# EAGLE design LACE_motherboard_xmega (EAGLE 5.07)
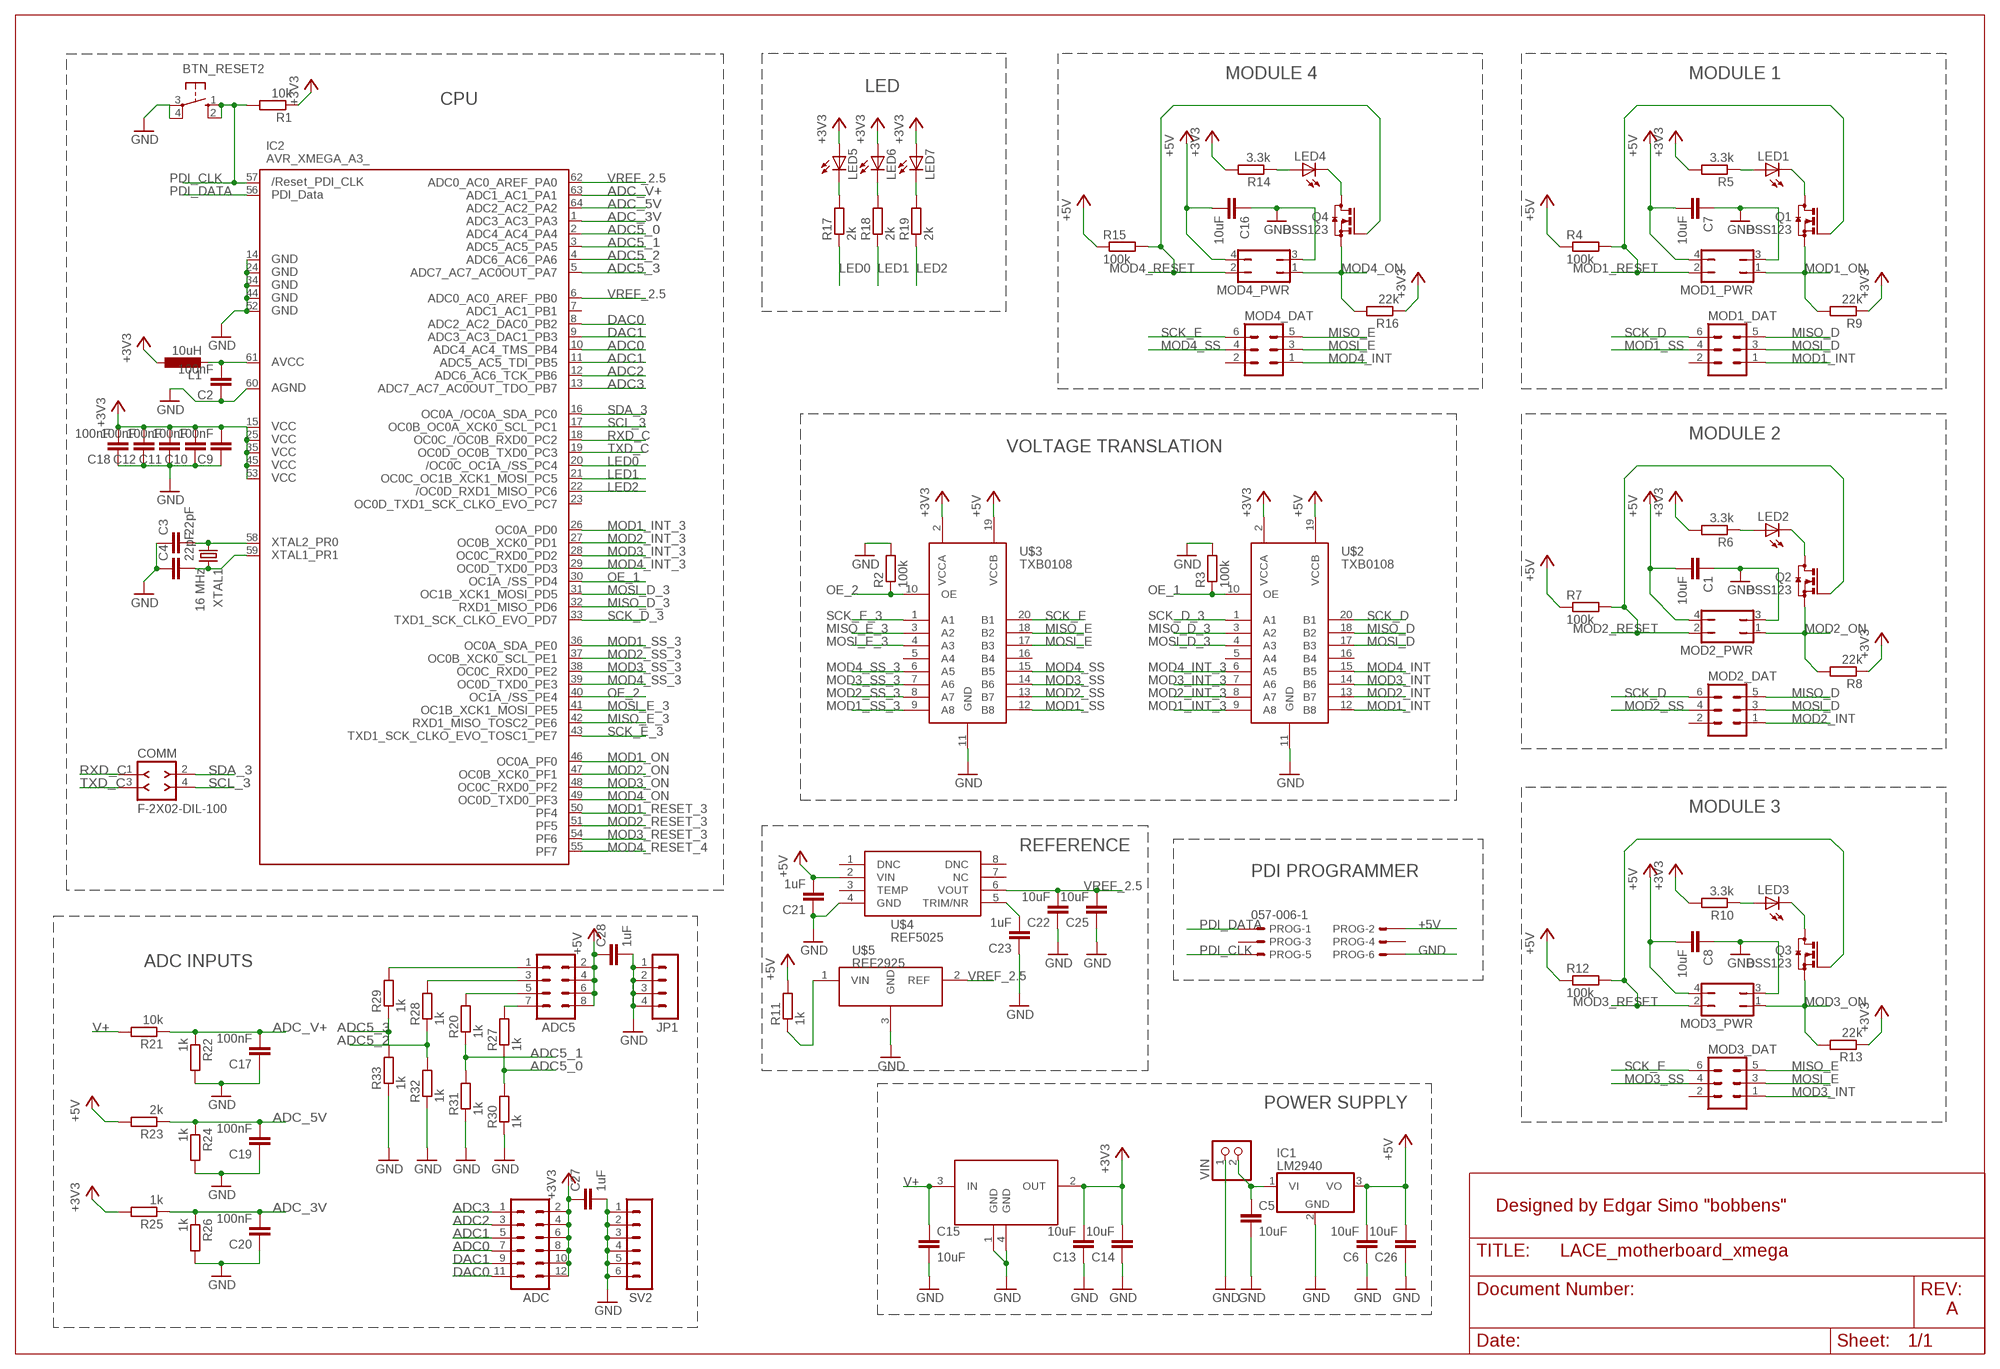
[diagram p0: schematic, sheet 1]

## Parts
ADC  MA06-2  [MA06-2]
ADC5  MA04-2  [MA04-2]
BTN_RESET2  10-XX  [B3F-10XX]
C1  10uF  C-EUC0805  [C0805]
C2  100nF  C-EUC0805  [C0805]
C3  22pF  C-EUC0805  [C0805]
C4  22pF  C-EUC0805  [C0805]
C5  10uF  C-EUC0805  [C0805]
C6  10uF  C-EUC0805  [C0805]
C7  10uF  C-EUC0805  [C0805]
C8  10uF  C-EUC0805  [C0805]
C9  100nF  C-EUC0805  [C0805]
C10  100nF  C-EUC0805  [C0805]
C11  100nF  C-EUC0805  [C0805]
C12  100nF  C-EUC0805  [C0805]
C13  10uF  C-EUC0805  [C0805]
C14  10uF  C-EUC0805  [C0805]
C15  10uF  C-EUC0805  [C0805]
C16  10uF  C-EUC0805  [C0805]
C17  100nF  C-EUC0805  [C0805]
C18  100nF  C-EUC0805  [C0805]
C19  100nF  C-EUC0805  [C0805]
C20  100nF  C-EUC0805  [C0805]
C21  1uF  C-EUC0805  [C0805]
C22  10uF  C-EUC0805  [C0805]
C23  1uF  C-EUC0805  [C0805]
C25  10uF  C-EUC0805  [C0805]
C26  10uF  C-EUC0805  [C0805]
C27  1uF  C-EUC0805  [C0805]
C28  1uF  C-EUC0805  [C0805]
COMM  F-2X02-DIL-100  [DIL-100-2X02]
IC1  LM2940  7815T  [TO220H]
IC2  AVR_XMEGA_A3_  [TQFP64]
JP1  MA04-1  [MA04-1]
L1  10uH  L-EUL0805  [L0805]
LED1  LEDCHIPLED_0805  [CHIPLED_0805]
LED2  LEDCHIPLED_0805  [CHIPLED_0805]
LED3  LEDCHIPLED_0805  [CHIPLED_0805]
LED4  LEDCHIPLED_0805  [CHIPLED_0805]
LED5  LEDCHIPLED_0805  [CHIPLED_0805]
LED6  LEDCHIPLED_0805  [CHIPLED_0805]
LED7  LEDCHIPLED_0805  [CHIPLED_0805]
MOD1_DAT  MA03-2  [MA03-2]
MOD1_PWR  JP2Q  [JP2Q]
MOD2_DAT  MA03-2  [MA03-2]
MOD2_PWR  JP2Q  [JP2Q]
MOD3_DAT  MA03-2  [MA03-2]
MOD3_PWR  JP2Q  [JP2Q]
MOD4_DAT  MA03-2  [MA03-2]
MOD4_PWR  JP2Q  [JP2Q]
PROG  057-006-1  [057-006-1]
Q1  BSS123  [SOT23]
Q2  BSS123  [SOT23]
Q3  BSS123  [SOT23]
Q4  BSS123  [SOT23]
R1  10k  R-EU_M0805  [M0805]
R2  100k  R-EU_M0805  [M0805]
R3  100k  R-EU_M0805  [M0805]
R4  100k  R-EU_M0805  [M0805]
R5  3.3k  R-EU_M0805  [M0805]
R6  3.3k  R-EU_M0805  [M0805]
R7  100k  R-EU_M0805  [M0805]
R8  22k  R-EU_M0805  [M0805]
R9  22k  R-EU_M0805  [M0805]
R10  3.3k  R-EU_M0805  [M0805]
R11  1k  R-EU_M0805  [M0805]
R12  100k  R-EU_M0805  [M0805]
R13  22k  R-EU_M0805  [M0805]
R14  3.3k  R-EU_M0805  [M0805]
R15  100k  R-EU_M0805  [M0805]
R16  22k  R-EU_M0805  [M0805]
R17  2k  R-EU_M0805  [M0805]
R18  2k  R-EU_M0805  [M0805]
R19  2k  R-EU_M0805  [M0805]
R20  1k  R-EU_M0805  [M0805]
R21  10k  R-EU_M0805  [M0805]
R22  1k  R-EU_M0805  [M0805]
R23  2k  R-EU_M0805  [M0805]
R24  1k  R-EU_M0805  [M0805]
R25  1k  R-EU_M0805  [M0805]
R26  1k  R-EU_M0805  [M0805]
R27  1k  R-EU_M0805  [M0805]
R28  1k  R-EU_M0805  [M0805]
R29  1k  R-EU_M0805  [M0805]
R30  1k  R-EU_M0805  [M0805]
R31  1k  R-EU_M0805  [M0805]
R32  1k  R-EU_M0805  [M0805]
R33  1k  R-EU_M0805  [M0805]
SV2  MA06-1  [MA06-1]
U$1  LM1117  [SOT223]
U$2  TXB0108  [R-PDSO-G20]
U$3  TXB0108  [R-PDSO-G20]
U$4  REF5025  [SOIC8]
U$5  REF2925  [SOT23]
VIN  PINHD-1X2  [1X02]
XTAL1  16 MHz  CRYSTALHC49S  [HC49/S]

## Nets
+3V3: ADC.2 ADC.4 ADC.6 ADC.8 ADC.10 ADC.12 C9.2 C10.2 C11.2 C12.2 C13.2 C14.2 C18.2 C27.1 IC2.15(VCC1) IC2.25(VCC2) IC2.35(VCC3) IC2.45(VCC4) IC2.53(VCC5) L1.1 LED5.A LED6.A LED7.A R1.1 R5.2 R6.2 R8.1 R9.1 R10.2 R13.1 R14.2 R16.1 R25.2 U$1.2(OUT) U$2.2(VCCA) U$3.2(VCCA)
+5V: ADC5.2 ADC5.4 ADC5.6 ADC5.8 C1.2 C6.2 C7.2 C8.2 C16.2 C21.2 C26.2 C28.1 IC1.3(VO) MOD1_PWR.4 MOD2_PWR.4 MOD3_PWR.4 MOD4_PWR.4 PROG.2 R4.1 R7.1 R11.2 R12.1 R15.1 R23.2 U$2.19(VCCB) U$3.19(VCCB) U$4.2(VIN)
ADC0: ADC.7 IC2.10(PB4)
ADC1: ADC.5 IC2.11(PB5)
ADC2: ADC.3 IC2.12(PB6)
ADC3: ADC.1 IC2.13(PB7)
ADC5_0: IC2.2(PA4) R27.1 R30.2
ADC5_1: IC2.3(PA5) R20.1 R31.2
ADC5_2: IC2.4(PA6) R28.1 R32.2
ADC5_3: IC2.5(PA7) R29.1 R33.2
ADC_3V: C20.2 IC2.1(PA3) R25.1 R26.1
ADC_5V: C19.2 IC2.64(PA2) R23.1 R24.1
ADC_V+: C17.2 IC2.63(PA1) R21.1 R22.1
DAC0: ADC.11 IC2.8(PB2)
DAC1: ADC.9 IC2.9(PB3)
GND: BTN_RESET2.3(P) BTN_RESET2.4(P1) C1.1 C2.1 C3.1 C4.1 C5.2 C6.1 C7.1 C8.1 C9.1 C10.1 C11.1 C12.1 C13.1 C14.1 C15.2 C16.1 C17.1 C18.1 C19.1 C20.1 C21.1 C22.1 C23.1 C25.1 C26.1 C27.2 C28.2 IC1.2(GND) IC2.14(GND1) IC2.24(GND2) IC2.34(GND3) IC2.44(GND4) IC2.52(GND5) IC2.60(AGND) JP1.1 JP1.2 JP1.3 JP1.4 MOD1_PWR.3 MOD2_PWR.3 MOD3_PWR.3 MOD4_PWR.3 PROG.6 R2.2 R3.2 R22.2 R24.2 R26.2 R30.1 R31.1 R32.1 R33.1 SV2.1 SV2.2 SV2.3 SV2.4 SV2.5 SV2.6 U$1.1(GND) U$1.4(GND) U$2.11(GND) U$3.11(GND) U$4.4(GND) U$5.3(GND) VIN.1
LED0: IC2.20(PC4) R17.1
LED1: IC2.21(PC5) R18.1
LED2: IC2.22(PC6) R19.1
MISO_D: MOD1_DAT.5 MOD2_DAT.5 U$2.18(B2)
MISO_D_3: IC2.32(PD6) U$2.3(A2)
MISO_E: MOD3_DAT.5 MOD4_DAT.5 U$3.18(B2)
MISO_E_3: IC2.42(PE6) U$3.3(A2)
MOD1_INT: MOD1_DAT.1 U$2.12(B8)
MOD1_INT_3: IC2.26(PD0) U$2.9(A8)
MOD1_ON: IC2.46(PF0) MOD1_PWR.1 Q1.2(S) R9.2
MOD1_RESET: MOD1_PWR.2 Q1.1(G) R4.2
MOD1_RESET_3: IC2.50(PF4)
MOD1_SS: MOD1_DAT.4 U$3.12(B8)
MOD1_SS_3: IC2.36(PE0) U$3.9(A8)
MOD2_INT: MOD2_DAT.1 U$2.13(B7)
MOD2_INT_3: IC2.27(PD1) U$2.8(A7)
MOD2_ON: IC2.47(PF1) MOD2_PWR.1 Q2.2(S) R8.2
MOD2_RESET: MOD2_PWR.2 Q2.1(G) R7.2
MOD2_RESET_3: IC2.51(PF5)
MOD2_SS: MOD2_DAT.4 U$3.13(B7)
MOD2_SS_3: IC2.37(PE1) U$3.8(A7)
MOD3_INT: MOD3_DAT.1 U$2.14(B6)
MOD3_INT_3: IC2.28(PD2) U$2.7(A6)
MOD3_ON: IC2.48(PF2) MOD3_PWR.1 Q3.2(S) R13.2
MOD3_RESET: MOD3_PWR.2 Q3.1(G) R12.2
MOD3_RESET_3: IC2.54(PF6)
MOD3_SS: MOD3_DAT.4 U$3.14(B6)
MOD3_SS_3: IC2.38(PE2) U$3.7(A6)
MOD4_INT: MOD4_DAT.1 U$2.15(B5)
MOD4_INT_3: IC2.29(PD3) U$2.6(A5)
MOD4_ON: IC2.49(PF3) MOD4_PWR.1 Q4.2(S) R16.2
MOD4_RESET: MOD4_PWR.2 Q4.1(G) R15.2
MOD4_RESET_4: IC2.55(PF7)
MOD4_SS: MOD4_DAT.4 U$3.15(B5)
MOD4_SS_3: IC2.39(PE3) U$3.6(A5)
MOSI_D: MOD1_DAT.3 MOD2_DAT.3 U$2.17(B3)
MOSI_D_3: IC2.31(PD5) U$2.4(A3)
MOSI_E: MOD3_DAT.3 MOD4_DAT.3 U$3.17(B3)
MOSI_E_3: IC2.41(PE5) U$3.4(A3)
N$1: C3.2 IC2.58(PR0) XTAL1.1
N$2: R11.1 U$5.1(VIN)
N$3: C4.2 IC2.59(PR1) XTAL1.2
N$5: C2.2 IC2.61(AVCC) L1.2
N$13: LED2.A R6.1
N$22: C23.2 U$4.5(TRIM/NR)
N$23: ADC5.1 R29.2
N$24: ADC5.3 R28.2
N$25: ADC5.5 R20.2
N$26: LED1.A R5.1
N$27: ADC5.7 R27.2
N$28: LED2.C Q2.3(D)
N$29: LED1.C Q1.3(D)
N$30: LED3.A R10.1
N$31: LED3.C Q3.3(D)
N$32: LED4.A R14.1
N$33: LED4.C Q4.3(D)
N$34: LED5.C R17.2
N$35: LED6.C R18.2
N$36: LED7.C R19.2
OE_1: IC2.30(PD4) R3.1 U$2.10(OE)
OE_2: IC2.40(PE4) R2.1 U$3.10(OE)
PDI_CLK: BTN_RESET2.1(S) BTN_RESET2.2(S1) IC2.57(RESET) PROG.5 R1.2
PDI_DATA: IC2.56(PDI_DATA) PROG.1
RXD_C: COMM.1 IC2.18(PC2)
SCK_D: MOD1_DAT.6 MOD2_DAT.6 U$2.20(B1)
SCK_D_3: IC2.33(PD7) U$2.1(A1)
SCK_E: MOD3_DAT.6 MOD4_DAT.6 U$3.20(B1)
SCK_E_3: IC2.43(PE7) U$3.1(A1)
SCL_3: COMM.4 IC2.17(PC1)
SDA_3: COMM.2 IC2.16(PC0)
TXD_C: COMM.3 IC2.19(PC3)
V+: C5.1 C15.1 IC1.1(VI) R21.2 U$1.3(IN) VIN.2
VREF_2.5: C22.2 C25.2 IC2.6(PB0) IC2.62(PA0) U$4.6(VOUT) U$5.2(REF)
Unconnected: IC2.7(PB1) IC2.23(PC7) MOD1_DAT.2 MOD2_DAT.2 MOD3_DAT.2 MOD4_DAT.2 PROG.3 PROG.4 U$2.5(A4) U$2.16(B4) U$3.5(A4) U$3.16(B4) U$4.1(DNC) U$4.3(TEMP) U$4.7(NC) U$4.8(DNC)

## Notes on the sheet
- MODULE 4 | MODULE 1
- LED
- CPU
- MODULE 2
- VOLTAGE TRANSLATION
- MODULE 3
- REFERENCE
- PDI PROGRAMMER
- ADC INPUTS
- POWER SUPPLY
- Designed by Edgar Simo "bobbens"
- A

## Library data of the parts
ADC = con-lstb:MA06-2: PIN HEADER
ADC5 = con-lstb:MA04-2: PIN HEADER
BTN_RESET2 = switch-omron:10-XX: OMRON SWITCH
C1-C23 C25-C28 = rcl:C-EU: CAPACITOR, European symbol
COMM = con-headers-jp:F-2X02-: FEMALE HEADER
IC1 = linear:78*: Positive VOLTAGE REGULATOR Source: http://cache.national.com/ds/LM/LM78L05.pdf http://www.fairchildsemi.com/ds/LM/LM7805.pdf
IC2 = xmega:AVR_XMEGA_A3_: Device for Atmel AVR XMEGA A3 Series
JP1 = con-lstb:MA04-1: PIN HEADER
L1 = rcl:L-EU: INDUCTOR, European symbol
LED1-LED7 = led:LED: LED OSRAM: - CHIPLED LG R971, LG N971, LY N971, LG Q971, LY Q971, LO R971, LY R971 LH N974, LH R974 LS Q976, LO Q976, LY Q976 LO Q996 - Hyper CHIPLED LW Q18S LB Q993, LB Q99A, LB R99A - SideLED LS A670, LO A670, LY A670, LG A670, LP A670 LB A673, LV A673, LT A673, LW A673 LH A674 LY A675 LS A676, LA A676, LO A676, LY A676, LW A676 LS A679, LY A679, LG A679 - Hyper Micro SIDELED® LS Y876, LA Y876, LO Y876, LY Y876 LT Y87S - SmartLED LW L88C, LW L88S LB L89C, LB L89S, LG L890 LS L89K, LO L89K, LY L89K LS L896, LA L896, LO L896, LY L896 - TOPLED LS T670, LO T670, LY T670, LG T670, LP T670 LSG T670, LSP T670, LSY T670, LOP T670, LYG T670 LG T671, LOG T671, LSG T671 LB T673, LV T673, LT T673, LW T673 LH T674 LS T676, LA T676, LO T676, LY T676, LB T676, LH T676, LSB T676, LW T676 LB T67C, LV T67C, LT T67C, LS T67K, LO T67K, LY T67K, LW E67C LS E67B, LA E67B, LO E67B, LY E67B, LB E67C, LV E67C, LT E67C LW T67C LS T679, LY T679, LG T679 LS T770, LO T770, LY T770, LG T770, LP T770 LB T773, LV T773, LT T773, LW T773 LH T774 LS E675, LA E675, LY E675, LS T675 LS T776, LA T776, LO T776, LY T776, LB T776 LHGB T686 LT T68C, LB T68C - Hyper Mini TOPLED® LB M676 - Mini TOPLED Santana® LG M470 LS M47K, LO M47K, LY M47K Source: http://www.osram.convergy.de LUXEON: - LUMILED® LXK2-PW12-R00, LXK2-PW12-S00, LXK2-PW14-U00, LXK2-PW14-V00 LXK2-PM12-R00, LXK2-PM12-S00, LXK2-PM14-U00 LXK2-PE12-Q00, LXK2-PE12-R00, LXK2-PE12-S00, LXK2-PE14-T00, LXK2-PE14-U00 LXK2-PB12-K00, LXK2-PB12-L00, LXK2-PB12-M00, LXK2-PB14-N00, LXK2-PB14-P00, LXK2-PB14-Q00 LXK2-PR12-L00, LXK2-PR12-M00, LXK2-PR14-Q00, LXK2-PR14-R00 LXK2-PD12-Q00, LXK2-PD12-R00, LXK2-PD12-S00 LXK2-PH12-R00, LXK2-PH12-S00 LXK2-PL12-P00, LXK2-PL12-Q00, LXK2-PL12-R00 Source: www.luxeon.com KINGBRIGHT: KA-3528ASYC Source: www.kingbright.com
MOD1_DAT MOD2_DAT MOD3_DAT MOD4_DAT = con-lstb:MA03-2: PIN HEADER
MOD1_PWR MOD2_PWR MOD3_PWR MOD4_PWR = jumper:JP2Q: JUMPER
PROG = con-panduit:057-006-: CONNECTOR 6-pin series 057 contact pc board low profile headers
Q1-Q4 = transistor-small-signal:BSS123: N-CHANNEL MOS FET
R1-R33 = rcl:R-EU_: RESISTOR, European symbol
SV2 = con-lstb:MA06-1: PIN HEADER
U$1 = bobbens:LM1117: LM1117 800mA Low-Dropout Linear Regulator
U$2 U$3 = bobbens:TXB0108: TXB0108 8-Bit Bidirectional Voltage-Level Translator with Auto Direction Sensing and +/-15-kV ESD Protect
U$4 = bobbens:REF5025: REF5025 Low Noise, Very Low Drift, Precision Voltage Reference
U$5 = bobbens:REF2925: REF2925 2.5V 100ppm/Degrees C, 50uA in SOT23-3 Series (Bandgap) Voltage Reference
VIN = pinhead:PINHD-1X2: PIN HEADER
XTAL1 = crystal:CRYSTAL: CRYSTAL

## Board
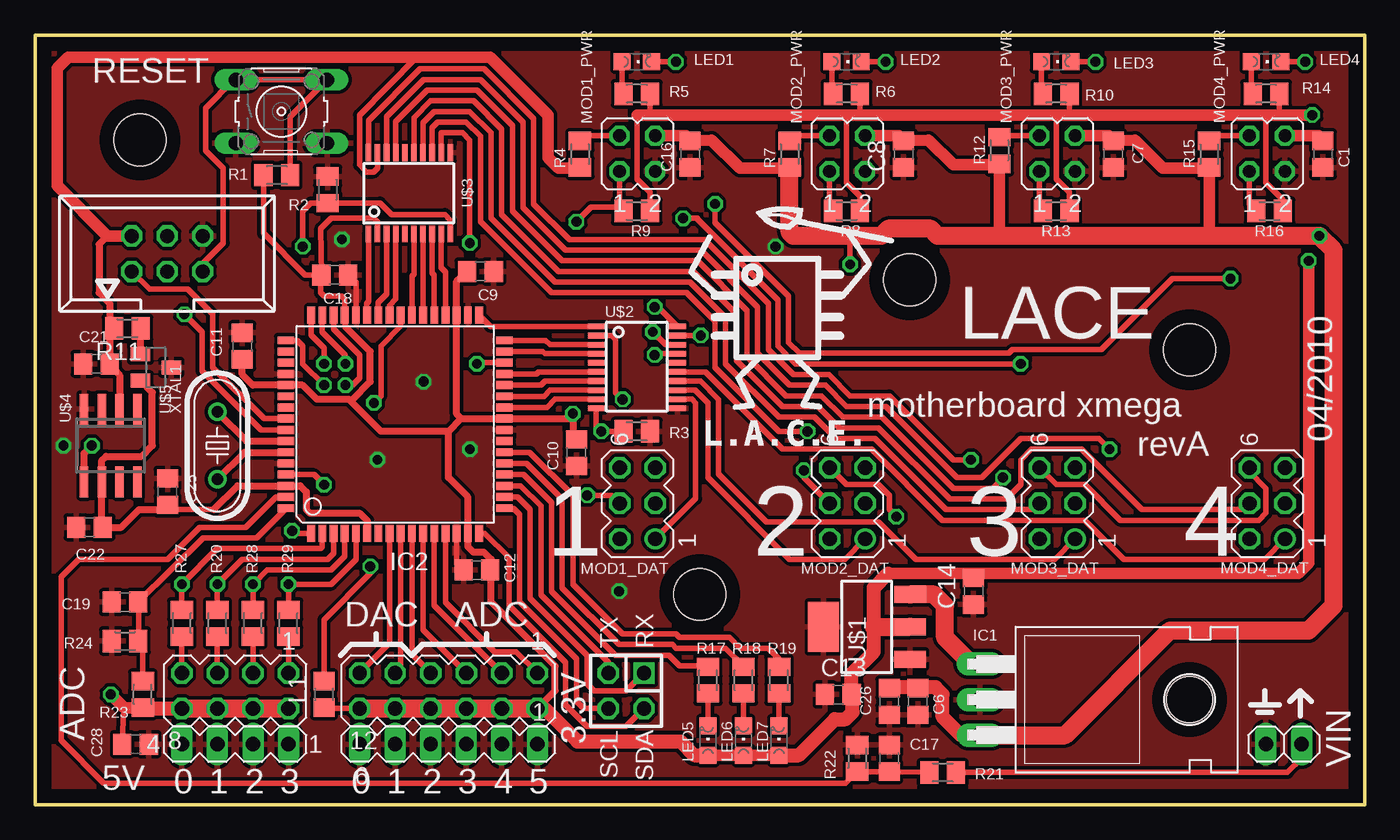
[diagram p1: board, top side]
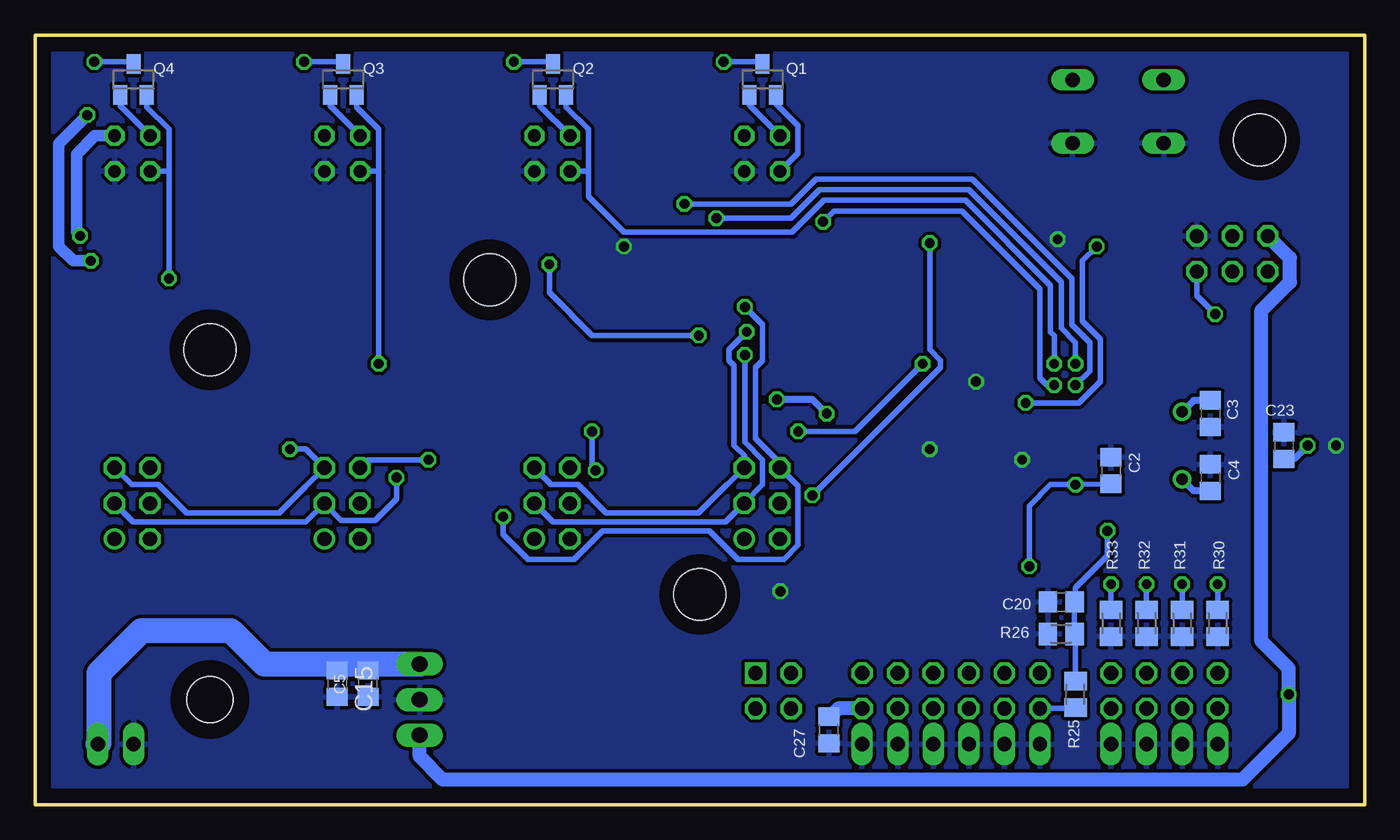
[diagram p2: board, bottom side, seen from below]

Size 95 x 55 mm. Coordinates in mm from the lower left corner, seen from the top.
Outline: 0,0 95,0 95,55 0,55 0,0
Copper layers (1*16): Top 0.035mm / dielectric 1.5mm / Bottom 0.035mm
Design rules "8mils *": minimum track width 8mil, minimum drill 0.7mm, track to track 8mil, track to pad 8mil, pad to pad 8mil, via to via 8mil, smd to smd 8mil, copper to edge 40mil, drill to drill 10mil, minimum pad ring 10mil, minimum via ring 8mil, stop-mask expansion 0mil, vias tented up to drill 0mil, thermal gap 10mil
Holes 3.7 mm at 82.5,32.5 7.5,47.5 47.5,15.03 62.5,37.5

### Footprints (pad centres in the part's own frame; a part is rotated, then mirrored left to right if it is on the bottom)
MA06-2 = drill 1.016 octagon: 1 -6.35,-1.27; 2 -6.35,1.27; 3 -3.81,-1.27; 4 -3.81,1.27; 5 -1.27,-1.27; 6 -1.27,1.27; 7 1.27,-1.27; 8 1.27,1.27; 9 3.81,-1.27; 10 3.81,1.27; 11 6.35,-1.27; 12 6.35,1.27
MA04-2 = drill 1.016 octagon: 1 -3.81,-1.27; 2 -3.81,1.27; 3 -1.27,-1.27; 4 -1.27,1.27; 5 1.27,-1.27; 6 1.27,1.27; 7 3.81,-1.27; 8 3.81,1.27
B3F-10XX = drill 1.016 long: 1 -3.251,2.261; 2 3.251,2.261; 3 -3.251,-2.261; 4 3.251,-2.261
C0805 = smd 1.3 x 1.5: 1 -0.95,0; 2 0.95,0
DIL-100-2X02 = drill 1.016 square: 1 -1.27,-1.27 | drill 1.016 octagon: 2 -1.27,1.27; 3 1.27,-1.27; 4 1.27,1.27
TO220H = drill 1.118 long: 1 -2.54,-10.16; 2 0,-10.16; 3 2.54,-10.16 | hole 3.302: 0,4.826
TQFP64 = smd 1.194 x 0.559: 1 -7.8,6; 2 -7.8,5.2; 3 -7.8,4.4; 4 -7.8,3.6; 5 -7.8,2.8; 6 -7.8,2; 7 -7.8,1.2; 8 -7.8,0.4; 9 -7.8,-0.4; 10 -7.8,-1.2; 11 -7.8,-2; 12 -7.8,-2.8; 13 -7.8,-3.6; 14 -7.8,-4.4; 15 -7.8,-5.2; 16 -7.8,-6; 33 7.8,-6; 34 7.8,-5.2; 35 7.8,-4.4; 36 7.8,-3.6; 37 7.8,-2.8; 38 7.8,-2; 39 7.8,-1.2; 40 7.8,-0.4; 41 7.8,0.4; 42 7.8,1.2; 43 7.8,2; 44 7.8,2.8; 45 7.8,3.6; 46 7.8,4.4; 47 7.8,5.2; 48 7.8,6 | smd 0.559 x 1.194: 17 -6,-7.8; 18 -5.2,-7.8; 19 -4.4,-7.8; 20 -3.6,-7.8; 21 -2.8,-7.8; 22 -2,-7.8; 23 -1.2,-7.8; 24 -0.4,-7.8; 25 0.4,-7.8; 26 1.2,-7.8; 27 2,-7.8; 28 2.8,-7.8; 29 3.6,-7.8; 30 4.4,-7.8; 31 5.2,-7.8; 32 6,-7.8; 49 6,7.8; 50 5.2,7.8; 51 4.4,7.8; 52 3.6,7.8; 53 2.8,7.8; 54 2,7.8; 55 1.2,7.8; 56 0.4,7.8; 57 -0.4,7.8; 58 -1.2,7.8; 59 -2,7.8; 60 -2.8,7.8; 61 -3.6,7.8; 62 -4.4,7.8; 63 -5.2,7.8; 64 -6,7.8
MA04-1 = drill 1.016 long: 1 -3.81,0; 2 -1.27,0; 3 1.27,0; 4 3.81,0
L0805 = smd 1.3 x 1.5: 1 -0.95,0; 2 0.95,0
CHIPLED_0805 = smd 1.2 x 1.2: A 0,-1.05; C 0,1.05
MA03-2 = drill 1.016 round: 1 -2.54,-1.27 | drill 1.016 octagon: 2 -2.54,1.27; 3 0,-1.27; 4 0,1.27; 5 2.54,-1.27; 6 2.54,1.27
JP2Q = drill 0.914 octagon: 1 -1.27,-1.27; 2 -1.27,1.27; 3 1.27,-1.27; 4 1.27,1.27
057-006-1 = drill 1 octagon: 1 -2.54,-1.27; 2 -2.54,1.27; 3 0,-1.27; 4 0,1.27; 5 2.54,-1.27; 6 2.54,1.27
SOT23 = smd 1 x 1.4: 1 -0.95,-1.1; 2 0.95,-1.1; 3 0,1.1
M0805 = smd 1.3 x 1.6: 1 -0.95,0; 2 0.95,0
MA06-1 = drill 1.016 long: 1 -6.35,0; 2 -3.81,0; 3 -1.27,0; 4 1.27,0; 5 3.81,0; 6 6.35,0
SOT223 = smd 1.219 x 2.235: 1 -2.311,-3.099; 2 0,-3.099; 3 2.311,-3.099 | smd 3.6 x 2.2: 4 0,3.099
R-PDSO-G20 = smd 0.4 x 1.2: 1 -2.925,-2.9; 2 -2.275,-2.9; 3 -1.625,-2.9; 4 -0.975,-2.9; 5 -0.325,-2.9; 6 0.325,-2.9; 7 0.975,-2.9; 8 1.625,-2.9; 9 2.275,-2.9; 10 2.925,-2.9; 11 2.925,2.9; 12 2.275,2.9; 13 1.625,2.9; 14 0.975,2.9; 15 0.325,2.9; 16 -0.325,2.9; 17 -0.975,2.9; 18 -1.625,2.9; 19 -2.275,2.9; 20 -2.925,2.9
SOIC8 = smd 0.6 x 2.2: 1 -1.905,-2.6; 2 -0.635,-2.6; 3 0.635,-2.6; 4 1.905,-2.6; 5 1.905,2.6; 6 0.635,2.6; 7 -0.635,2.6; 8 -1.905,2.6
1X02 = drill 1.016 long: 1 -1.27,0; 2 1.27,0
HC49/S = drill 0.813 round: 1 -2.413,0; 2 2.413,0

### Placement (x,y rotation side)
ADC  29.54,8.13 180 top
ADC5  14.3,8.13 180 top
BTN_RESET2  17.61,49.53 0 top
C1  92.03,46.48 90 top
C2  18.11,23.88 270 bottom
C3  11,27.94 90 bottom
C4  11,23.37 270 bottom
C5  71.2,8.64 270 bottom
C6  63.07,7.37 90 top
C7  77.04,46.48 90 top
C8  62.06,46.48 90 top
C9  31.83,38.1 180 top
C10  38.69,25.15 90 top
C11  14.81,32.77 270 top
C12  31.58,16.76 0 top
C13  57.4,7.87 0 top
C14  67.06,15.24 90 top
C15  73.41,8.64 270 bottom
C16  46.82,46.48 90 top
C17  61.04,3.3 270 top
C18  21.42,37.85 180 top
C19  6.43,14.48 0 top
C20  21.67,14.48 0 bottom
C21  4.4,31.5 0 top
C22  3.89,19.81 0 top
C23  5.76,25.65 270 bottom
C25  9.48,22.35 270 top
C26  61.04,7.37 90 top
C27  38.27,5.33 270 bottom
C28  7.19,4.32 0 top
COMM  42.24,8.13 180 top
IC1  77.68,7.5 270 top
IC2  25.73,27.18 90 top
JP1  14.3,4.32 180 top
L1  20.65,7.87 90 top
LED1  43.01,53.09 270 top
LED2  57.99,53.09 270 top
LED3  72.98,53.09 270 top
LED4  87.96,53.09 270 top
LED5  48.09,4.57 0 top
LED6  50.63,4.57 0 top
LED7  53.17,4.57 0 top
MOD1_DAT  43.05,21.52 90 top
MOD1_PWR  43.05,46.52 0 top
MOD2_DAT  58.05,21.52 90 top
MOD2_PWR  58.05,46.52 0 top
MOD3_DAT  73.05,21.52 90 top
MOD3_PWR  73.05,46.52 0 top
MOD4_DAT  88.05,21.52 90 top
MOD4_PWR  88.05,46.52 0 top
PROG  9.45,39.37 0 top
Q1  43.01,51.82 0 bottom
Q2  57.99,51.82 0 bottom
Q3  72.98,51.82 0 bottom
Q4  87.96,51.82 0 bottom
R1  17.27,44.98 0 top
R2  20.91,43.94 90 top
R3  43.01,26.67 0 top
R4  38.94,46.48 90 top
R5  43.01,50.8 0 top
R6  57.99,50.8 0 top
R7  53.93,46.48 90 top
R8  57.99,42.42 180 top
R9  43.01,42.42 180 top
R10  72.98,50.8 0 top
R11  6.6,34.04 180 top
R12  68.91,46.74 90 top
R13  72.98,42.42 180 top
R14  87.96,50.8 0 top
R15  83.9,46.48 90 top
R16  88.22,42.42 180 top
R17  48.09,8.89 270 top
R18  50.63,8.89 270 top
R19  53.17,8.89 270 top
R20  13.03,12.95 270 top
R21  64.85,2.29 0 top
R22  58.75,3.3 90 top
R23  7.7,7.87 270 top
R24  6.43,11.68 180 top
R25  20.65,7.87 270 bottom
R26  21.67,12.19 180 bottom
R27  10.49,12.95 270 top
R28  15.57,12.95 270 top
R29  18.11,12.95 270 top
R30  10.49,12.95 90 bottom
R31  13.03,12.95 90 bottom
R32  15.57,12.95 90 bottom
R33  18.11,12.95 90 bottom
SV2  29.54,4.32 180 top
U$1  59.44,12.7 90 top
U$2  43.01,31.24 270 top
U$3  26.75,43.69 0 top
U$4  5.41,25.65 180 top
U$5  8.64,31.24 270 top
VIN  89.23,4.32 0 top
XTAL1  13.03,25.65 270 top

### Tracks (layer width: path | path; a pad name or v marks a point on that pad's centre or on a via)
+3V3  (via drill 0.7)
  Top 0.406: 32.59,16.78 C12.2 | ADC.12 20.72,6.86 L1.1 | U$3.2 24.48,41.65 24.21,41.91 21.16,41.91 20.42,41.16 C18.2 | C18.2 20.4,37.83 20.4,36.58 20.65,36.32 21.92,36.32 22.13,36.11 IC2.45 22.18,34.93 22.18,34.16 | R16.1 89.17,43.25 87.96,44.45 87.96,49.28 | 88.91,49.53 88.91,49.46 | R13.1 73.93,43.75 72.98,44.7 72.98,49.28 | R9.1 43.96,43.75 43.01,44.7 43.01,49.28 | 88.91,49.53 88.59,49.21 88.28,49.21 88.22,49.28 | 22.43,28.96 22.69,28.96 | R5.2 43.96,49.46 43.77,49.28 | R8.1 58.94,43.5 57.99,44.45 57.99,49.28 | R6.2 58.94,49.34 59.01,49.28 | R10.2 73.93,49.46 73.74,49.28 | 88.91,49.53 R14.2 | U$2.2 41.24,33.52 41.48,33.27 41.48,29.46 v41.99,28.96 | 38.43,26.4 C10.2 | 38.29,27.58 38.43,27.43 | C18.2 19.3,37.85 16.32,40.83 R1.1 | C14.2 67.31,16.19 67.31,16.51
  Top 0.508: C11.2 14.81,30.73 15.57,29.98 IC2.53 19.12,29.98 20.15,28.96 22.43,28.96 24.72,26.67 29.54,26.67 | ADC.2 37.16,8.13 37.16,9.91 32.59,14.48 32.59,16.78 32.59,17.53 32.08,18.03 31.32,18.03 30.93,18.42 IC2.15 30.93,21.98 29.54,23.37 29.54,26.67 | C9.2 30.13,37.4 IC2.35 30.13,27.9 30.45,27.58 | 22.69,28.96 23.96,30.23 23.96,32.38 22.18,34.16 | 38.43,26.4 38.43,27.43 v38.43,27.94 | 38.29,27.58 IC2.25 30.45,27.58 | 29.54,26.67 30.45,27.58
  Top 0.813: LED5.A LED6.A LED7.A | 43.01,49.28 43.77,49.28 57.99,49.28 59.01,49.28 72.98,49.28 73.74,49.28 87.96,49.28 88.22,49.28 v91.27,49.28 | 60.96,16.51 67.31,16.51 90.25,16.51 91.01,17.27 v91.01,38.86
  Top 1.016: LED5.A 47.1,3.52 46.12,4.51 38.75,4.51 36.4,6.86 ADC.2 | LED7.A 54.58,3.52 57.15,6.1 57.91,6.1 58.42,6.6 58.42,7.81 C13.2 58.35,9.33 59.94,10.92 59.94,12.7 59.94,15.49 60.96,16.51
  Top 1.27: ADC.12 ADC.10 ADC.8 ADC.6 ADC.4 ADC.2 | 59.94,12.7 U$1.2
  Bottom 0.406: ADC.12 20.72,6.86 L1.1
  Bottom 0.508: v41.99,28.96 39.45,28.96 v38.43,27.94
  Bottom 0.813: v91.01,38.86 92.28,38.86 93.3,39.88 93.3,47.24 v91.27,49.28
  Bottom 1.016: C27.1 38.17,6.28 37.59,6.86 ADC.2
+5V  (via drill 0.7)
  Top 0.406: R23.2 7.77,6.86 | R7.1 53.86,45.47 | R12.1 68.85,45.72 | R15.1 83.83,45.47 | 69.42,40.64 68.91,41.15 | 84.15,40.64 83.9,40.89 | U$3.19 24.48,45.48 24.21,45.21 23.7,45.21 23.19,45.72 23.19,49.28 27.26,53.42 | U$2.19 47.57,33.52 v47.58,33.53 | 55.71,40.64 55.45,40.39 | v58.25,38.61 58.25,40.39 59.26,40.64 | C28.1 6.34,6.9 6.36,6.92 | R11.2 5.54,33.72 5.35,33.53
  Top 0.508: U$4.2 6.05,30.7 C21.2 5.35,33.53 5.35,35.8 4.57,36.58 4.57,40.05 5.16,40.64
  Top 0.813: MOD4_PWR.4 91.72,47.79 C1.2 | MOD3_PWR.4 76.73,47.79 C7.2 78.58,47.48 80.6,45.47 83.83,45.47 | MOD2_PWR.4 61.74,47.79 C8.2 63.85,47.48 65.61,45.72 68.85,45.72 | MOD1_PWR.4 46.5,47.79 C16.2 48.36,47.48 50.37,45.47 53.86,45.47 | 68.91,41.15 R12.1 | 83.9,40.89 R15.1 | R23.2 6.36,6.92 v5.41,7.87 | PROG.2 5.16,40.64 1.57,44.23 1.57,52.63 2.36,53.42 27.26,53.42 32.52,53.42 36.66,49.28 36.66,46.23 37.42,45.47 38.88,45.47 R4.1
  Top 1.016: 7.77,6.86 ADC5.8 | 63.33,8.38 61.06,8.38 C26.2 | 63.33,8.38 64.34,8.38 64.85,7.87 64.85,6.27 66.16,4.96 IC1.3 | C6.2 63.31,8.37 63.33,8.38
  Top 1.27: ADC5.8 ADC5.6 ADC5.4 ADC5.2 | R7.1 53.93,40.89 54.18,40.64 55.71,40.64 59.26,40.64 60.45,40.64 60.96,41.15 64.01,41.15 64.52,40.64 69.42,40.64 84.15,40.64 v91.77,40.64 92.79,39.62 92.79,14.22 91.01,12.45 81.11,12.45 73.62,4.96 IC1.3
  Bottom 0.406: v47.58,33.53 55.2,33.53 58.25,36.58 v58.25,38.61
  Bottom 0.813: MOD4_PWR.4 90.72,47.79 92.03,46.48 92.03,40.89 v91.77,40.64
  Bottom 1.016: PROG.2 5.33,39.06 5.33,37.34 7.37,35.31 7.37,11.68 5.41,9.73 v5.41,7.87 5.41,5.08 8.72,1.78 65.87,1.78 67.52,3.43 IC1.3
ADC0
  Top 0.406: IC2.10 26.93,10.74 ADC.7
ADC1
  Top 0.406: IC2.11 27.73,12.48 ADC.5
ADC2
  Top 0.406: IC2.12 28.53,14.22 ADC.3
ADC3
  Top 0.406: IC2.13 29.33,14.43 32.85,10.92 34.37,10.92 ADC.1
ADC5_0  (via drill 0.7)
  Top 0.406: R27.1 v10.49,15.75 13.03,18.29 20.4,18.29 20.53,18.42 IC2.2
  Bottom 0.406: v10.49,15.75 R27.1
ADC5_1  (via drill 0.7)
  Top 0.406: R20.1 v13.03,15.75 14.81,17.53 20.91,17.53 21.33,17.95 IC2.3
  Bottom 0.406: v13.03,15.75 R20.1
ADC5_2  (via drill 0.7)
  Top 0.406: R28.1 v15.57,15.75 16.59,16.76 21.16,16.76 22.13,17.74 IC2.4
  Bottom 0.406: v15.57,15.75 R28.1
ADC5_3  (via drill 0.7)
  Top 0.406: IC2.5 22.93,17.52 21.16,15.75 v18.11,15.75 R29.1
  Bottom 0.406: v18.11,15.75 R29.1
ADC_3V  (via drill 0.7)
  Top 0.406: IC2.1 18.55,19.38 v18.37,19.56
  Bottom 0.406: R25.1 20.65,12.13 R26.1 C20.2 20.65,14.49 20.65,15.49 18.37,17.78 v18.37,19.56
ADC_5V
  Top 0.406: R23.1 7.7,11.36 R24.1 7.43,11.73 C19.2 12,19.05 15.83,19.05 17.93,21.16 IC2.64
ADC_V+
  Top 0.406: R21.1 63.88,2.3 C17.2 R22.1 57.93,1.52 4.91,1.52 1.86,4.57 1.86,16.26 3.13,17.53 9.48,17.53 11.76,19.81 15.07,19.81 17.23,21.98 IC2.63
DAC0
  Top 0.406: IC2.8 25.33,11.54 ADC.11
DAC1
  Top 0.406: IC2.9 26.13,9.8 ADC.9
GND  (via drill 0.7)
  Top 0.406: IC2.14 30.13,17.21 C12.1 | IC2.44 22.93,37.33 C18.1
  other vias: 21.92,40.39 41.74,15.24 52.91,39.88 31.07,25.4 24.46,24.64 27.77,30.23 2.03,25.65
  pour Bottom (isolate 0.254): -0.51,55.45 95.33,55.45 95.33,-0.51 -0.51,-0.51
  pour Top (isolate 0.254): -0.51,55.2 94.31,55.2 94.31,0.76 0.51,0.76
LED0
  Top 0.406: IC2.20 34.92,23.58 36.91,21.59 36.91,15.24 41.48,10.67 45.29,10.67 46.05,9.91 48.02,9.91 R17.1
LED1
  Top 0.406: R18.1 50.63,9.91 49.36,11.18 45.8,11.18 45.55,11.43 41.74,11.43 37.67,15.49 37.67,21.84 35.14,24.38 IC2.21
LED2
  Top 0.406: IC2.22 35.35,25.18 38.43,22.1 38.43,15.75 41.99,12.19 45.8,12.19 46.05,11.94 49.61,11.94 50.37,11.18 52.4,11.18 53.17,10.41 R19.1
MISO_D  (via drill 0.7)
  Top 0.406: U$2.18 45.06,32.87 v44.15,33.78
  Bottom 0.406: MOD2_DAT.5 58.12,22.86 56.21,22.86 54.18,20.83 47.58,20.83 45.55,22.86 45.52,22.86 MOD1_DAT.5 44.32,24.93 45.04,25.65 45.04,31.37 45.42,31.75 45.42,32.51 v44.15,33.78
MISO_D_3
  Top 0.406: U$2.3 36.81,32.87 36.5,33.18 IC2.32
MISO_E  (via drill 0.7)
  Top 0.406: U$3.18 25.12,49.17 27.77,51.82 31.83,51.82 34.88,48.77 34.88,42.67 37.93,39.62 47.58,39.62 51.64,35.56 51.64,32.26 53.93,29.97 56.47,29.97 57.99,28.45 60.79,28.45 65.87,23.37 67.64,23.37 70.44,26.16 76.03,26.16 v76.79,25.4
  Bottom 0.406: MOD4_DAT.5 89.3,24.06 88.09,22.86 86.19,22.86 84.15,20.83 77.55,20.83 75.65,22.73 MOD3_DAT.5 75.65,25.4 v76.79,25.4
MISO_E_3
  Top 0.406: IC2.42 24.53,35.88 25.12,36.48 U$3.3
MOD1_INT
  Top 0.406: U$2.12 46.93,28.97 47.2,28.7 47.2,21.86 MOD1_DAT.1
MOD1_INT_3
  Top 0.406: U$2.9 37.17,28.97 36.59,28.38 IC2.26
MOD1_ON  (via drill 0.7)
  Top 0.406: 41.78,42.7 MOD1_PWR.1 | 41.78,42.7 R9.2 | 41.78,42.7 39.73,42.7 v38.69,41.66 | IC2.46 21.33,33.99 23.19,32.13 23.19,30.48 22.69,29.97 v22.18,29.97
  Bottom 0.406: Q1.2 42.06,50.1 40.47,48.51 40.47,46.57 MOD1_PWR.1 | v22.18,29.97 22.69,29.97 23.19,30.48 23.19,36.83 28.78,42.42 37.93,42.42 v38.69,41.66
MOD1_RESET
  Top 0.406: MOD1_PWR.2 39.3,47.79 R4.2
  Bottom 0.406: Q1.1 43.96,49.97 MOD1_PWR.2
MOD1_SS  (via drill 0.7)
  Top 0.406: U$3.12 29.02,47.99 29.04,48.01 30.56,48.01 31.07,47.5 v31.07,40.13 | v39.45,22.1 41.2,22.1 MOD1_DAT.4
  Bottom 0.406: v31.07,40.13 31.07,32.51 30.31,31.75 30.31,31.24 v39.45,22.1
MOD1_SS_3
  Top 0.406: U$3.9 29.02,38.37 29.33,38.06 IC2.36
MOD2_INT
  Top 0.406: U$2.13 47.17,29.62 48.09,28.7 48.09,23.37 53.93,17.53 57.86,17.53 MOD2_DAT.1
MOD2_INT_3
  Top 0.406: IC2.27 36.37,29.18 36.81,29.62 U$2.8
MOD2_ON  (via drill 0.7)
  Top 0.406: MOD2_PWR.1 56.78,42.68 R8.2 | v22.18,31.5 22.18,32.13 20.53,33.77 IC2.47
  Bottom 0.406: Q2.2 57.04,49.85 55.45,48.26 55.45,45.21 | 55.45,45.21 55.45,43.43 52.91,40.89 40.89,40.89 38.61,43.18 28.53,43.18 22.43,37.08 22.43,33.78 22.18,33.53 v22.18,31.5 | MOD2_PWR.1 55.49,45.25 55.45,45.21
MOD2_RESET
  Top 0.406: MOD2_PWR.2 54.29,47.79 R7.2
  Bottom 0.406: Q2.1 58.94,49.96 MOD2_PWR.2
MOD2_SS  (via drill 0.7)
  Top 0.406: U$3.13 28.38,48.36 28.78,48.77 30.81,48.77 31.83,47.75 31.83,41.66 36.91,36.58 46.56,36.58 48.59,34.54 48.59,31.24 53.17,26.67 v55.2,26.67 | v54.94,23.88 54.94,23.36 MOD2_DAT.4
  Bottom 0.406: v55.2,26.67 55.2,24.13 v54.94,23.88
MOD2_SS_3
  Top 0.406: U$3.8 28.38,38 28.53,37.84 IC2.37
MOD3_INT
  Top 0.406: U$2.14 47.54,30.27 48.85,28.96 48.85,23.62 52.28,20.19 60.28,20.19 62.95,17.53 72.86,17.53 MOD3_DAT.1
MOD3_INT_3
  Top 0.406: IC2.28 36.15,29.98 36.44,30.27 U$2.7
MOD3_ON  (via drill 0.7)
  Top 0.406: MOD3_PWR.1 71.78,42.67 R13.2 | v46.31,41.91 47.32,41.91 47.32,41.83 53.09,36.07 53.09,32.77 54.36,31.5 v70.44,31.5 | v20.65,31.5 20.65,32.64 19.73,33.56 IC2.48
  Bottom 0.406: Q3.2 72.03,49.85 70.44,48.26 70.44,45.21 | v70.44,31.5 70.44,45.21 | v46.31,41.91 40.97,41.91 38.94,43.94 28.27,43.94 21.67,37.34 21.67,34.04 20.65,33.02 v20.65,31.5 | MOD3_PWR.1 70.48,45.25 70.44,45.21
MOD3_RESET
  Top 0.406: MOD3_PWR.2 69.02,47.79 R12.2
  Bottom 0.406: Q3.1 73.93,49.94 MOD3_PWR.2
MOD3_SS
  Top 0.406: U$3.14 27.73,48.73 28.53,49.53 31.07,49.53 32.59,48.01 32.59,41.91 37.16,37.34 46.82,37.34 49.36,34.8 49.36,31.5 53.17,27.69 55.71,27.69 57.23,26.16 60.02,26.16 65.1,21.08 71.34,21.08 MOD3_DAT.4
MOD3_SS_3
  Top 0.406: U$3.7 IC2.38
MOD4_INT
  Top 0.406: U$2.15 47.9,30.92 53.42,25.4 59.77,25.4 64.85,20.32 75.01,20.32 77.8,17.53 87.86,17.53 MOD4_DAT.1
MOD4_INT_3
  Top 0.406: IC2.29 35.85,30.78 35.99,30.92 U$2.6
MOD4_ON  (via drill 0.7)
  Top 0.406: MOD4_PWR.1 86.78,42.91 R16.2 | IC2.49 18.72,33.18 19.13,32.77 19.13,31.5 v20.65,29.97 | v85.42,37.59 81.28,37.59 76.2,32.51 69.85,32.51 69.6,32.26 54.61,32.26 53.85,33.02 53.85,36.32 48.59,41.58 v48.59,42.93
  Bottom 0.406: Q4.2 87.01,49.85 85.42,48.26 85.42,45.21 | v85.42,37.59 85.42,45.21 | v48.59,42.93 40.97,42.93 39.2,44.7 28.02,44.7 20.91,37.59 20.91,34.29 19.64,33.02 19.64,30.99 v20.65,29.97 | MOD4_PWR.1 85.47,45.25 85.42,45.21
MOD4_RESET
  Top 0.406: MOD4_PWR.2 84.26,47.79 R15.2
  Bottom 0.406: Q4.1 88.91,49.93 MOD4_PWR.2
MOD4_SS
  Top 0.406: U$3.15 27.07,49.09 28.27,50.29 31.32,50.29 33.35,48.26 33.35,42.16 37.42,38.1 47.07,38.1 50.12,35.05 50.12,31.75 53.42,28.45 55.96,28.45 57.48,26.92 60.28,26.92 65.36,21.84 69.42,21.84 70.44,22.86 70.44,24.64 71.2,25.4 74.76,25.4 79.07,21.08 86.34,21.08 MOD4_DAT.4
MOD4_SS_3
  Top 0.406: U$3.6 27.07,37.92 26.93,37.78 IC2.39
MOSI_D  (via drill 0.7)
  Top 0.406: U$2.17 44.36,32.22 v44.28,32.13
  Bottom 0.406: MOD2_DAT.3 57.99,20.19 45.67,20.19 44.34,21.52 MOD1_DAT.3 44.32,21.55 43.01,22.86 43.01,24.64 44.28,25.91 v44.28,32.13
MOSI_D_3
  Top 0.406: U$2.4 36.44,32.22 36.28,32.38 IC2.31
MOSI_E  (via drill 0.7)
  Top 0.406: U$3.17 25.77,48.81 28.02,51.05 31.58,51.05 34.12,48.51 34.12,42.42 37.67,38.86 47.32,38.86 50.88,35.31 50.88,32 53.67,29.21 56.21,29.21 57.74,27.69 60.53,27.69 65.61,22.61 68.41,22.61 v69.17,23.37
  Bottom 0.406: MOD4_DAT.3 87.99,20.19 75.64,20.19 MOD3_DAT.3 73.11,20.32 70.69,20.32 69.17,21.84 v69.17,23.37
MOSI_E_3
  Top 0.406: IC2.41 25.33,35.67 25.77,36.11 U$3.4
N$1
  Top 0.508: IC2.58 15.12,25.98 XTAL1.1
  Bottom 0.508: C3.2 12.21,28.89 XTAL1.1
N$2
  Top 0.406: 7.54,34.04 R11.1
  Top 0.508: U$5.1 7.54,34.04
N$3
  Top 0.508: IC2.59 14.97,25.18 XTAL1.2
  Bottom 0.508: C4.2 12.21,22.42 XTAL1.2
N$5  (via drill 0.7)
  Top 0.406: IC2.61 19.94,23.58 v20.65,22.86 | L1.2 20.65,13.21 23.96,16.51 v23.96,17.02
  Bottom 0.406: C2.2 20.64,22.88 v20.65,22.86 22.43,22.86 23.96,21.34 v23.96,17.02
N$13
  Top 0.406: LED2.A 56.94,50.9 R6.1
N$22  (via drill 0.7)
  Top 0.508: U$4.5 3.51,25.1 v4.06,25.65
  Bottom 0.406: 5.01,24.7 C23.2
  Bottom 0.508: v4.06,25.65 5.01,24.7
N$23
  Top 0.406: ADC5.1 R29.2
N$24
  Top 0.406: ADC5.3 R28.2
N$25
  Top 0.406: ADC5.5 R20.2
N$26
  Top 0.406: LED1.A 41.96,50.9 R5.1
N$27
  Top 0.406: ADC5.7 R27.2
N$28  (via drill 0.7)
  Top 0.406: v60.79,53.09 LED2.C
  Bottom 0.406: v60.79,53.09 58.16,53.09 Q2.3
N$29  (via drill 0.7)
  Top 0.406: v45.8,53.09 LED1.C
  Bottom 0.406: v45.8,53.09 43.18,53.09 Q1.3
N$30
  Top 0.406: LED3.A 71.93,50.9 R10.1
N$31  (via drill 0.7)
  Top 0.406: v75.77,53.09 LED3.C
  Bottom 0.406: v75.77,53.09 73.15,53.09 Q3.3
N$32
  Top 0.406: LED4.A 86.91,50.9 R14.1
N$33  (via drill 0.7)
  Top 0.406: v90.76,53.09 LED4.C
  Bottom 0.406: v90.76,53.09 88.13,53.09 Q4.3
N$34
  Top 0.406: LED5.C R17.2
N$35
  Top 0.406: LED6.C R18.2
N$36
  Top 0.406: LED7.C R19.2
OE_1  (via drill 0.7)
  Top 0.406: R3.1 v40.47,26.67 40.11,27.03 U$2.10 | IC2.30 31.66,31.58 v31.58,31.5
  Bottom 0.406: v40.47,26.67 36.4,26.67 v31.58,31.5
OE_2  (via drill 0.7)
  Top 0.406: U$3.10 29.68,41.78 29.29,42.16 25.48,42.16 24.65,42.99 R2.1 19.7,42.99 19.13,42.42 v19.13,39.88 | IC2.40 26.13,34.18 24.72,32.77 24.72,29.21 v24.21,28.7
  Bottom 0.406: v24.21,28.7 20.4,28.7 18.88,30.23 18.88,33.27 20.15,34.54 20.15,38.86 v19.13,39.88
PDI_CLK  (via drill 0.7)
  Top 0.406: R1.2 18.22,49.16 BTN_RESET2.2 BTN_RESET2.1 14.2,51.79 12.19,49.78 12.19,46.74 13.46,45.47 13.46,40.13 11.99,38.66 PROG.5 | IC2.57 16.15,26.78 11.94,30.99 11.94,33.78 v10.67,35.05
  Bottom 0.406: v10.67,35.05 11.99,36.37 PROG.5
PDI_DATA
  Top 0.406: IC2.56 16.36,27.58 12.7,31.24 12.7,35.05 10.92,36.83 8.18,36.83 PROG.1
RXD_C
  Top 0.406: IC2.18 34.49,21.98 35.39,21.08 35.39,14.73 39.45,10.67 39.45,8.64 39.96,8.13 42.24,8.13 COMM.1
SCK_D  (via drill 0.7)
  Top 0.406: v44.28,35.56 44.51,35.56 U$2.20 | MOD2_DAT.6 57.99,22.86 60.28,22.86 61.04,22.1 61.04,21.08 v61.55,20.57
  Bottom 0.406: v44.28,35.56 43.01,34.29 43.01,31.75 43.51,31.24 43.51,26.16 41.78,24.43 MOD1_DAT.6 40.47,22.75 40.47,18.54 41.48,17.53 44.78,17.53 46.82,19.56 54.44,19.56 56.47,17.53 59.77,17.53 61.55,19.3 v61.55,20.57
SCK_D_3
  Top 0.406: U$2.1 32.55,34.17 IC2.33
SCK_E  (via drill 0.7)
  Top 0.406: MOD4_DAT.6 86.78,23.79 87.96,22.61 87.96,20.83 87.46,20.32 77.55,20.32 75.01,22.86 72.98,22.86 MOD3_DAT.6 | U$3.20 23.82,48.89 27.51,52.58 32.08,52.58 35.64,49.02 35.64,42.93 38.18,40.39 47.83,40.39 52.4,35.81 52.4,32.51 54.18,30.73 56.72,30.73 58.25,29.21 61.04,29.21 65.61,24.64 v66.88,24.64
  Bottom 0.406: v66.88,24.64 71.2,24.64 MOD3_DAT.6
SCK_E_3
  Top 0.406: U$3.1 23.82,35.94 23.7,35.81 23.7,35.01 IC2.43
SCL_3
  Top 0.406: COMM.4 39.2,6.86 38.69,7.37 38.69,10.41 34.62,14.48 34.62,20.75 34.19,21.18 IC2.17 33.61,21.1
SDA_3
  Top 0.406: IC2.16 32.14,19.38 33.86,17.65 33.86,14.22 37.93,10.16 37.93,7.11 39.45,5.59 42.24,5.59 COMM.2
TXD_C
  Top 0.406: COMM.3 40.97,10.16 36.15,14.99 36.15,21.34 34.71,22.78 IC2.19
V+
  Top 0.406: VIN.2 90.5,3.3 89.49,2.29 R21.2
  Top 1.016: IC1.1 66.92,10.04
  Top 1.27: 66.92,10.04 65.02,11.94 65.02,14.22 64.24,15.01 U$1.3
  Bottom 0.406: C5.1 71.2,9.71 70.87,10.04
  Bottom 1.27: 73.41,10.04 C15.1
  Bottom 1.778: IC1.1 70.87,10.04 73.41,10.04 78.62,10.04 81.03,12.45 87.38,12.45 90.42,9.4 90.42,4.4 VIN.2
VREF_2.5
  Top 0.305: 9.48,21.08 C25.2
  Top 0.406: 9.48,21.08 12.78,21.08 | C22.2 4.78,19.92 | 7.55,30.29 U$5.2
  Top 0.508: IC2.6 23.73,20.29 23.19,20.83 19.64,20.83 19.38,21.08 19.38,22.35 18.96,22.78 IC2.62 14.48,22.78 12.78,21.08 | 9.48,21.08 7.45,21.08 6.18,19.81 C22.2 | 4.78,19.92 U$4.6 4.78,24.59 5.08,24.89 7.62,24.89 8.38,25.65 8.38,29.46 7.55,30.29

### Text on the board
tNames: RESET | LACE | motherboard xmega | 04/2010 | revA | 1 | 2 | 3 | 4 | DAC | ADC | TX | RX | ADC | SCL | SDA | 3.3V | 5V | 0 | 1 | 2 | 3 | 0 | 1 | 2 | 3 | 4 | 5